# Altium schematic sheet nlf15-art_piece.SchDoc
size A3
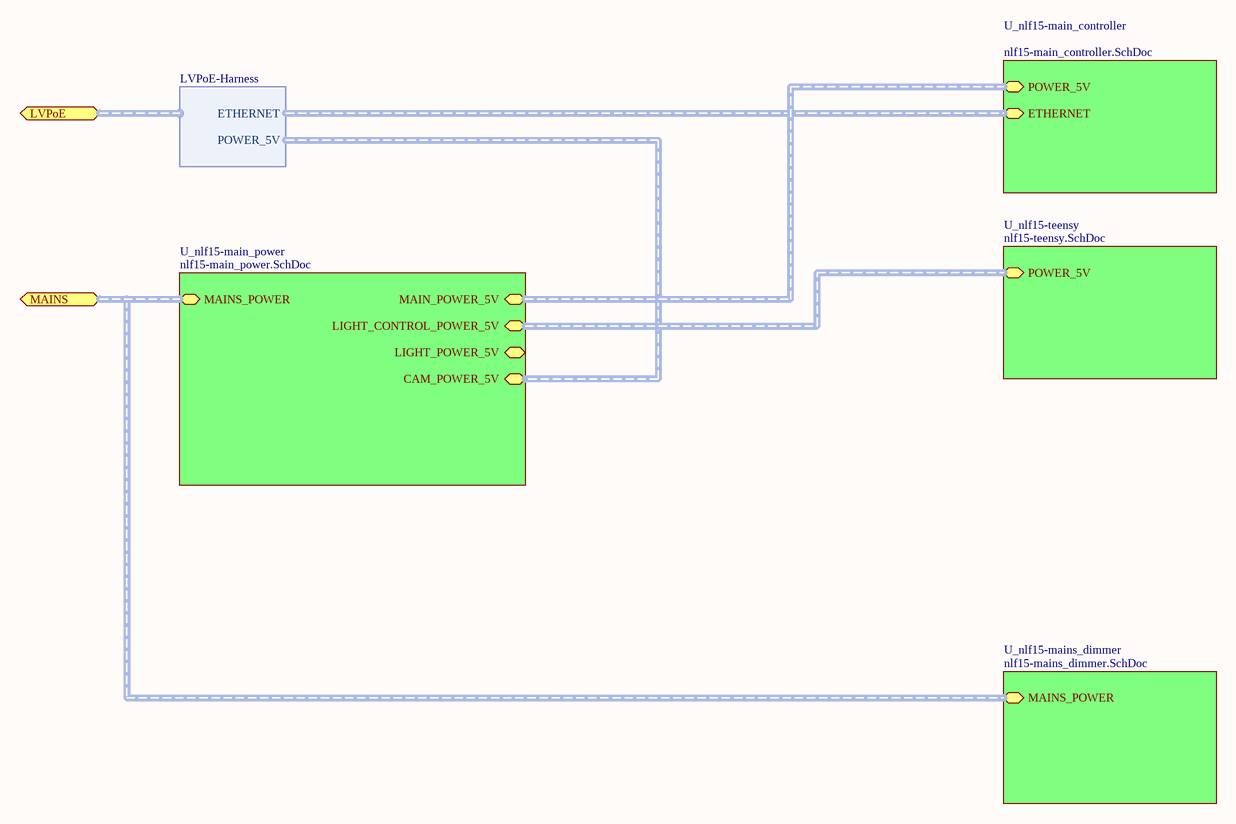
[diagram p0: nlf15-art_piece.SchDoc]

## Sub-sheets
U_nlf15-main_controller = nlf15-main_controller.SchDoc: ETHERNET (harness ETHERNET-Harness), POWER_5V (harness POWER_5V-Harness)
U_nlf15-main_power = nlf15-main_power.SchDoc: MAINS_POWER (harness MAINS-Harness), MAIN_POWER_5V (harness POWER_5V-Harness), LIGHT_CONTROL_POWER_5V (harness POWER_5V-Harness), LIGHT_POWER_5V (harness POWER_5V-Harness), CAM_POWER_5V (harness POWER_5V-Harness)
U_nlf15-mains_dimmer = nlf15-mains_dimmer.SchDoc: MAINS_POWER (harness MAINS-Harness)
U_nlf15-teensy = nlf15-teensy.SchDoc: POWER_5V (harness POWER_5V-Harness)

## Ports
LVPoE (harness LVPoE-Harness), MAINS (harness MAINS)

## Harnesses
LVPoE-Harness: ETHERNET, POWER_5V

## Buses and harness runs
harness port MAINS = sheet U_nlf15-main_power/MAINS_POWER = sheet U_nlf15-mains_dimmer/MAINS_POWER
harness sheet U_nlf15-main_controller/POWER_5V = sheet U_nlf15-main_power/MAIN_POWER_5V
harness sheet U_nlf15-main_power/LIGHT_CONTROL_POWER_5V = sheet U_nlf15-teensy/POWER_5V